# EAGLE design sensor_v8 (EAGLE 7.1.0)
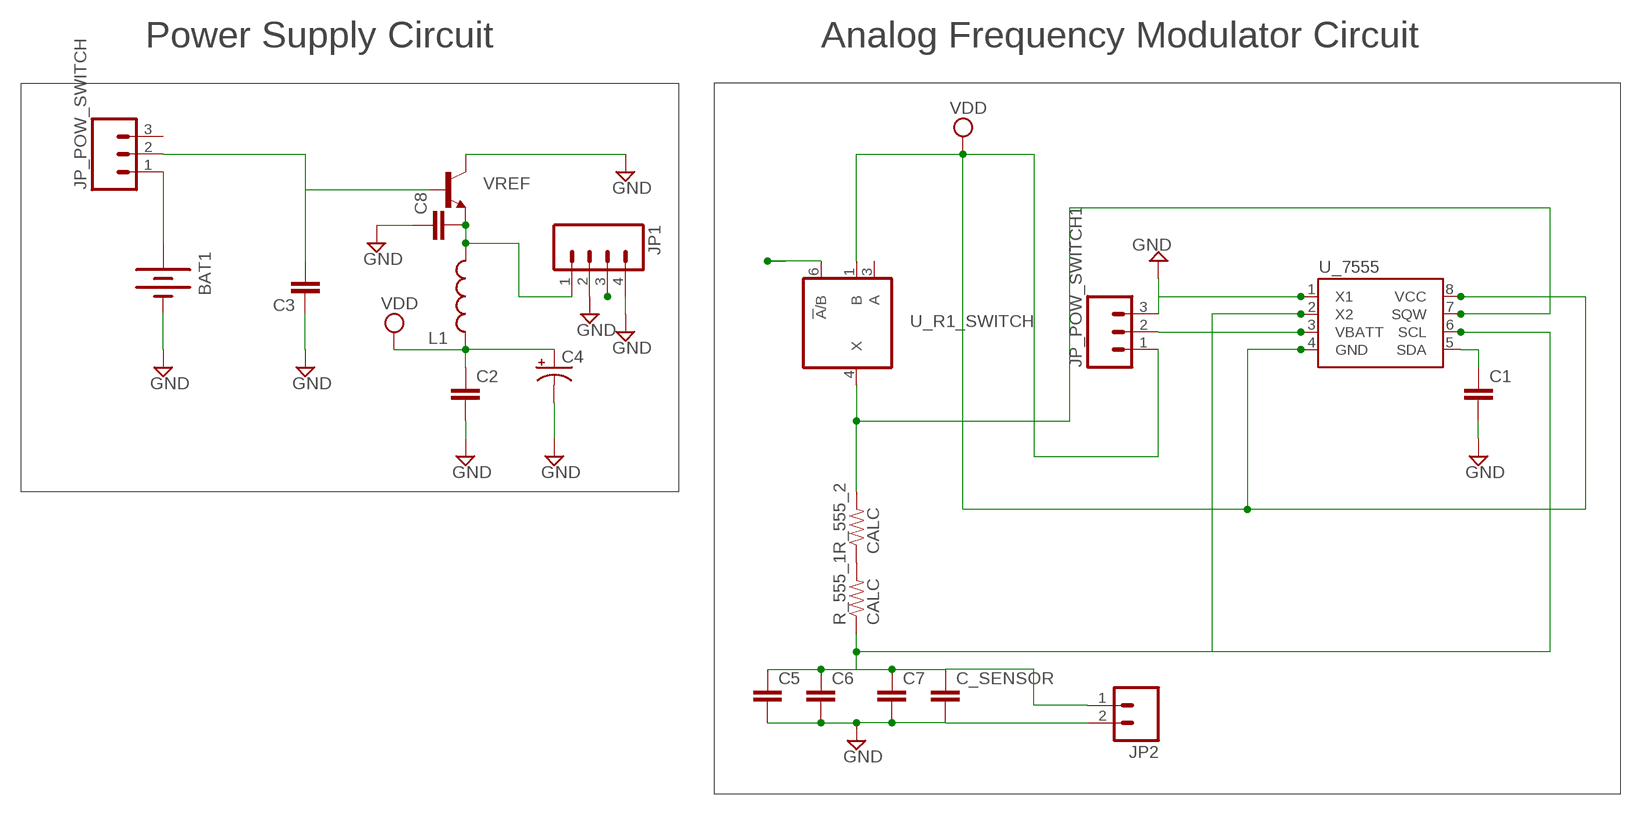
[diagram p0: schematic, sheet 1]

## Parts
BAT1  BATTERY20PTH_LAB  [BATTCOM_20MM_PTH]
C1  CAP0603-CAP  [0603-CAP]
C2  CAP0603-CAP  [0603-CAP]
C3  CAP0603-CAP  [0603-CAP]
C4  CAP_POL1206  [EIA3216]
C5  CAP0805  [0805]
C6  CAP0805  [0805]
C7  CAP0805  [0805]
C8  CAP0603-CAP  [0603-CAP]
C_SENSOR  CAP0805  [0805]
JP1  M04LOCK  [1X04_LOCK]
JP2  M02PTH  [1X02]
JP_POW_SWITCH  M03LOCK  [1X03_LOCK]
JP_POW_SWITCH1  M03LOCK  [1X03_LOCK]
L1  INDUCTOR0603  [0603]
R_555_1  CALC  RESISTOR0805-RES  [0805]
R_555_2  CALC  RESISTOR0805-RES  [0805]
U_7555  DS1307SO8  [SO08]
U_R1_SWITCH  741G3157DCKR  [DCK_R-PDSO-G6]
U_VREF  TRANSISTOR_NPNSOT23-3  [SOT23-3]

## Nets
FOUT: JP_POW_SWITCH1.2 U_7555.3(VBATT) U_R1_SWITCH.6(!A!/B)
GND: BAT1.2(-) C1.2 C2.2 C3.1 C4.C(-) C5.2 C6.2 C7.2 C8.1 C_SENSOR.2 JP1.2 JP1.4 JP2.2 JP_POW_SWITCH1.3 U_7555.1(X1) U_VREF.3(C)
N$6: BAT1.1(+) JP1.3 JP_POW_SWITCH.1
N$9: R_555_1.2 R_555_2.1
P2: C5.1 C6.1 C7.1 C_SENSOR.1 JP2.1 R_555_1.1 U_7555.2(X2) U_7555.6(SCL)
P5: C1.1 U_7555.5(SDA)
P7: R_555_2.2 U_7555.7(SQW) U_R1_SWITCH.4(X)
VDD: C2.1 C4.A(+) JP_POW_SWITCH1.1 L1.1 U_7555.4(GND) U_7555.8(VCC) U_R1_SWITCH.1(B)
VREFIN: C3.2 JP_POW_SWITCH.2 U_VREF.1(B)
VREFOUT: C8.2 JP1.1 L1.2 U_VREF.2(E)
Unconnected: JP_POW_SWITCH.3 U_R1_SWITCH.3(A)

## Notes on the sheet
- Power Supply Circuit | Analog Frequency Modulator Circuit
- VREF

## Power pins joined to a net without a drawn wire
GND: U_R1_SWITCH.2(GND)
VCC: U_R1_SWITCH.5(VCC)

## Library data of the parts
BAT1 = semipassiveTag_library:BATTERY: Battery Holders Various common sizes : AA, AAA, 20mm coin cell and 12mm coin cell.
C1-C3 C8 = SparkFun-Capacitors:CAP: Capacitor Standard 0603 ceramic capacitor, and 0.1" leaded capacitor.
C4 = SparkFun-Capacitors:CAP_POL: Capacitor Polarized These are standard SMD and PTH capacitors. Normally 10uF, 47uF, and 100uF in electrolytic and tantalum varieties. Always verify the external diameter of the through hole cap, it varies with capacity, voltage, and manufacturer. The EIA devices should be standard.
C5-C7 C_SENSOR = SparkFun:CAP: Capacitor Standard 0603 ceramic capacitor, and 0.1" leaded capacitor.
JP1 = SparkFun-Connectors:M04: Header 4 Standard 4-pin 0.1" header. Use with straight break away headers (SKU : PRT-00116), right angle break away headers (PRT-00553), swiss pins (PRT-00743), machine pins (PRT-00117), and female headers (PRT-00115). Molex polarized connector foot print use with SKU : PRT-08231 with associated crimp pins and housings. 1MM SMD Version SKU: PRT-10208
JP2 = SparkFun:M02: Header 2 Standard 2-pin 0.1" header. Use with straight break away headers (SKU : PRT-00116), right angle break away headers (PRT-00553), swiss pins (PRT-00743), machine pins (PRT-00117), and female headers (PRT-00115). Molex polarized connector foot print use with SKU : PRT-08233 with associated crimp pins and housings.
JP_POW_SWITCH JP_POW_SWITCH1 = SparkFun-Connectors:M03: Header 3 Standard 3-pin 0.1" header. Use with straight break away headers (SKU : PRT-00116), right angle break away headers (PRT-00553), swiss pins (PRT-00743), machine pins (PRT-00117), and female headers (PRT-00115). Molex polarized connector foot print use with SKU : PRT-08232 with associated crimp pins and housings.
L1 = SparkFun-Passives:INDUCTOR: Inductors Basic Inductor/Choke - 0603 and 1206. Footprints are not proven and vary greatly between part numbers.
R_555_1 R_555_2 = SparkFun-Resistors:RESISTOR: Resistor Basic schematic elements and footprints for 0603, 1206, and PTH resistors.
U_7555 = SparkFun-FreqCtrl:DS1307: I2C real-time clock with battery backup.
U_R1_SWITCH = 74xx-little-de:74*1G3157: Single-Pole, Double-Throw Analog Switch Source: http://focus.ti.com/lit/ds/symlink/sn74lvc1g3157.pdf
U_VREF = SparkFun:TRANSISTOR_NPN: Transistor NPN BJT configuration in SOT23 package. MMBT2222 is the common NPN we use. Double check BCE configuration again layout.

## Board
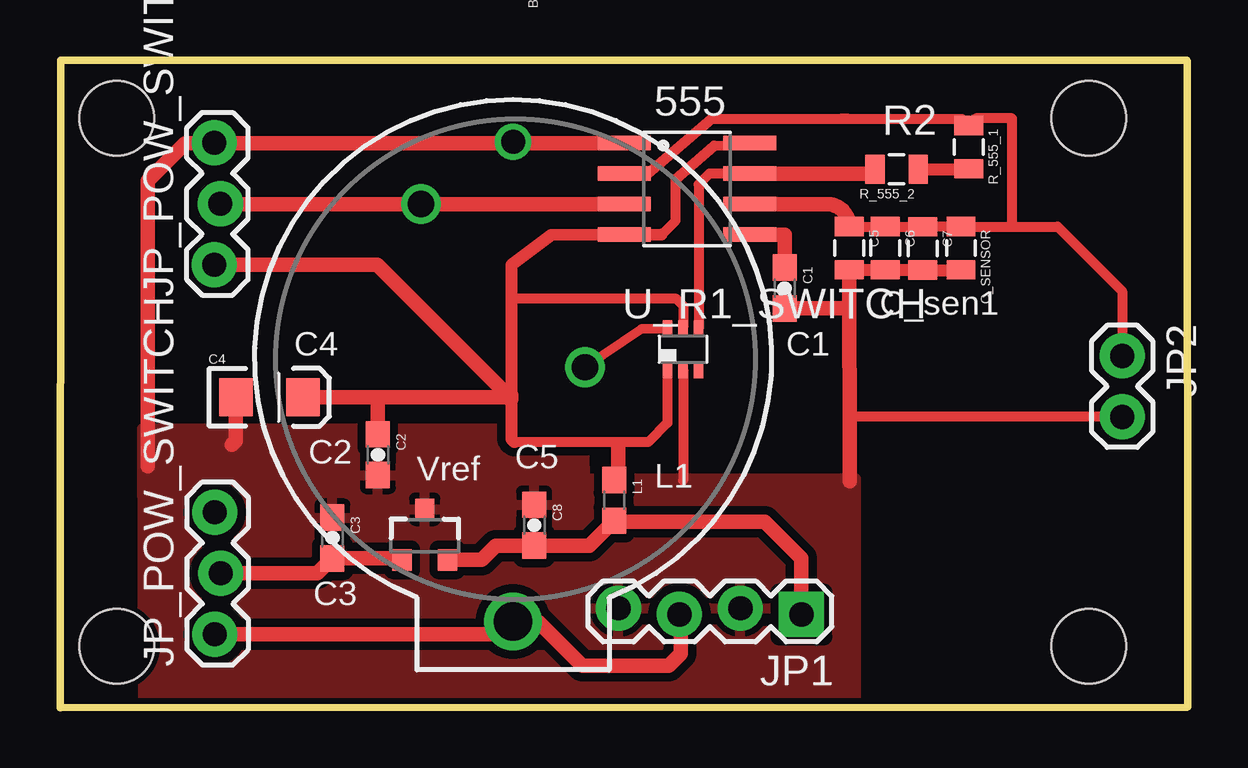
[diagram p1: board, top side]
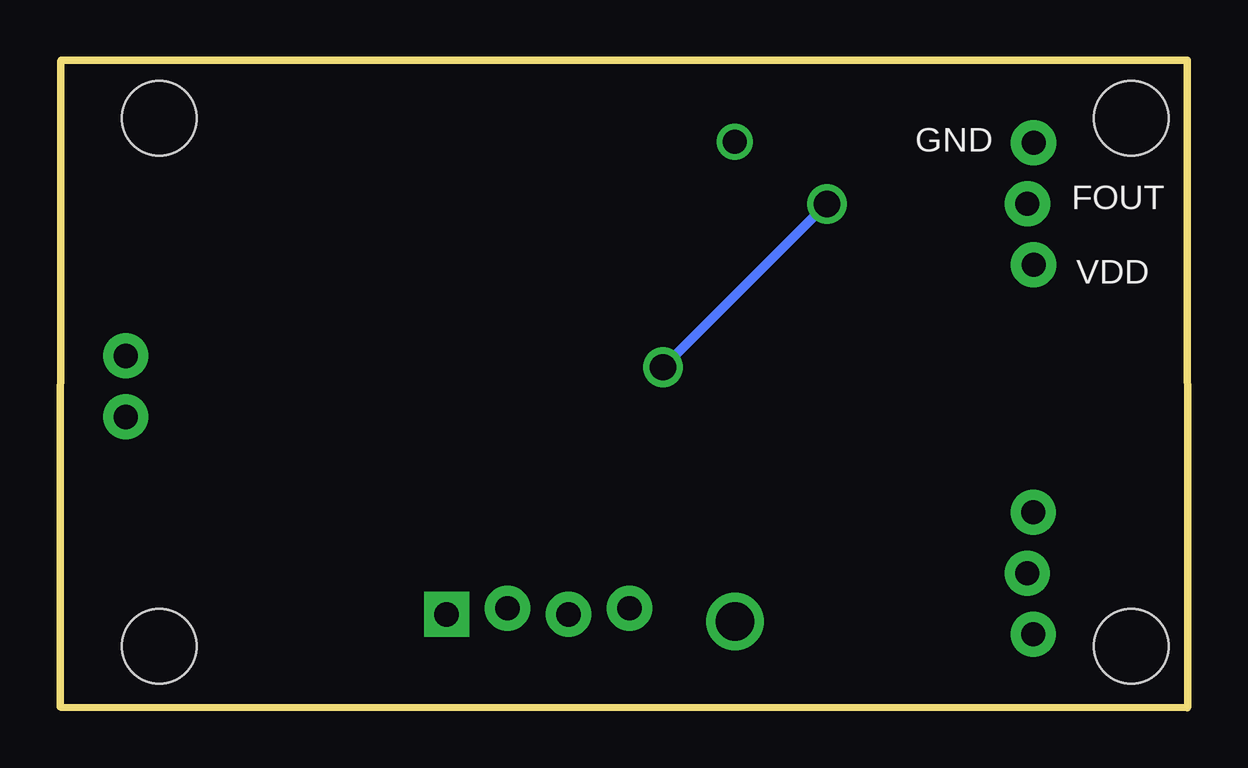
[diagram p2: board, bottom side, seen from below]

Size 47 x 26.98 mm. Coordinates in mm from the lower left corner, seen from the top.
Outline: 46.96,26.93 47,0.02
Outline: 0.03,26.97 0,0.03
Outline: 46.95,26.97 0.08,26.98
Outline: 0.02,0 46.95,0.01
Copper layers (1*16): Top 0.035mm / dielectric 1.5mm / Bottom 0.035mm
Design rules "Fusion_eagle_rule_v1.1 *": minimum track width 12mil, minimum drill 12mil, track to track 14mil, track to pad 14mil, pad to pad 14mil, via to via 14mil, smd to smd 0mil, copper to edge 10mil, drill to drill 10mil, minimum pad ring 10mil, minimum via ring 6mil, stop-mask expansion 2mil, vias tented up to drill 100mil, thermal gap 10mil
Holes 3.1 mm at 42.86,2.55 42.86,24.55 2.36,2.55 2.36,24.55

### Footprints (pad centres in the part's own frame; a part is rotated, then mirrored left to right if it is on the bottom)
BATTCOM_20MM_PTH = drill 1.6: 1 19.99,0 | drill 1: 2 0,0
0603-CAP = smd 1.1 x 1: 1 -0.85,0; 2 0.85,0
EIA3216 = smd 1.4 x 1.6: A 1.4,0; C -1.4,0
0805 = smd 0.8 x 1.2: 1 -0.9,0; 2 0.9,0
1X04_LOCK = drill 1.016 pad 1.88 square: 1 0,0.127 | drill 1.016 pad 1.88: 2 2.54,-0.127; 3 5.08,0.127; 4 7.62,-0.127
1X02 = drill 1.016 pad 1.88: 1 0,0; 2 2.54,0
1X03_LOCK = drill 1 pad 1.88: 1 0,0.127; 2 2.54,-0.127; 3 5.08,0.127
0603 = smd 1.1 x 1: 1 -0.85,0; 2 0.85,0
SO08 = smd 0.61 x 2.21: 1 -1.905,-2.616; 2 -0.635,-2.616; 3 0.635,-2.616; 4 1.905,-2.616; 5 1.905,2.616; 6 0.635,2.616; 7 -0.635,2.616; 8 -1.905,2.616
DCK_R-PDSO-G6 = smd 0.4 x 0.7: 1 -0.65,-0.85; 2 0,-0.85; 3 0.65,-0.85; 4 0.65,0.85; 5 0,0.85; 6 -0.65,0.85
SOT23-3 = smd 0.8 x 0.9: 1 -0.95,-1; 2 0.95,-1; 3 0,1.1

### Placement (x,y rotation side)
BAT1  18.88,23.57 270 top
C1  30.19,17.48 270 top
C2  13.24,10.54 270 top
C3  11.34,7.07 270 top
C4  8.73,12.93 0 top
C5  32.89,19.14 270 top
C6  34.39,19.14 270 top
C7  35.95,19.13 270 top
C8  19.76,7.6 270 top
C_SENSOR  37.54,19.14 270 top
JP1  30.89,4.01 180 top
JP2  44.26,14.65 270 top
JP_POW_SWITCH  6.57,3.05 90 top
JP_POW_SWITCH1  6.56,18.45 90 top
L1  23.09,8.63 270 top
R_555_1  37.86,23.35 270 top
R_555_2  34.86,22.43 180 top
U_7555  26.13,21.61 270 top
U_R1_SWITCH  25.96,14.93 0 top
U_VREF  15.2,7.15 0 top

### Tracks (layer width: path | path; a pad name or v marks a point on that pad's centre or on a via)
FOUT  (via drill 1.1)
  Top 0.4: U_R1_SWITCH.6 24.24,15.78 v21.87,14.18
  Top 0.406: JP_POW_SWITCH1.2 6.56,20.99
  Top 0.61: 23.5,20.97 arc45 U_7555.3 v15.05,20.98 6.69,20.98 JP_POW_SWITCH1.2
  Bottom 0.406: v21.87,14.18 v15.06,20.99 v15.06,20.98 v15.05,20.98
GND
  Top 0.406: C5.2 35.36,18.24 | U_R1_SWITCH.2 25.96,9.45 | 18.93,23.52 BAT1.2 | 6.45,23.52 6.43,23.52 JP_POW_SWITCH1.3 | JP2.2 32.96,12.11 32.9,12.05
  Top 0.5: C5.2 C6.2 35.36,18.24 C7.2 C_SENSOR.2
  Top 0.61: C5.2 32.89,16.25 | 32.89,16.25 32.9,12.05 32.9,9.42 | U_7555.1 18.93,23.52 6.45,23.52 5.23,23.52 3.66,21.95 3.66,10.05 | C1.2 32.89,16.63 32.89,16.25 | C4.C 7.33,11.12 7.16,10.95
  pour Top: 3.42,11.63 21.82,11.63 21.86,9.55 33.16,9.55 33.16,-0.05 3.46,0.05
N$4
  Top 0.406: 18.79,17.04 18.79,17.03 25.68,17.03 25.96,16.75 25.96,15.85
N$6
  Top 0.61: 18.88,3.55 BAT1.1 | BAT1.1 19.93,3.58 21.76,1.75 25.36,1.75 25.86,2.25 25.86,3.83 JP1.3 | JP_POW_SWITCH.1 18.34,3.05 BAT1.1
N$9
  Top 0.5: R_555_2.1 37.86,22.43 R_555_1.2
P2
  Top 0.406: 23.59,22.22 23.46,22.22 U_7555.2 24.48,22.22 27.16,24.53 32.86,24.53 | 32.86,24.53 32.56,24.54 | C5.1 C6.1 C7.1 35.95,20.05 | 39.66,20.04 39.66,24.55 38.16,24.55 R_555_1.1 37.58,24.53 32.86,24.53 | 39.66,20.04 C_SENSOR.1 35.95,20.05 | 35.41,20.05 35.95,20.05 | 39.66,20.04 41.57,20.04 44.26,17.35 JP2.1
  Top 0.6: 31.95,20.98 arc-90 C5.1
  Top 0.61: U_7555.6 31.95,20.98
P5
  Top 0.406: U_7555.5 29.49,19.71
  Top 0.61: 29.49,19.71 30.19,19.71 C1.1
P7
  Top 0.406: U_7555.7 27.06,22.25 26.61,21.8 U_R1_SWITCH.4
  Top 0.61: U_7555.7 33.96,22.25 R_555_2.2
VDD
  Top 0.4: 27.26,23.41 28.05,23.41 28.05,23.49
  Top 0.406: U_7555.4 25.07,19.71 25.65,20.29 25.65,22.01 27.26,23.41 | 28.05,23.49 U_7555.8 | 18.64,12.93 18.68,12.88 | U_R1_SWITCH.1 25.31,11.86 24.51,11.06 23.16,11.06 | 23.16,11.06 18.93,11.06 | 23.26,10.96 23.16,11.06
  Top 0.5: 18.81,13.01 18.81,18.43 20.47,19.69 25.07,19.71 | 18.81,12.85 18.81,11.18 18.93,11.06
  Top 0.61: 18.68,12.88 18.81,13.01 18.81,12.9 | 23.26,9.48 L1.1 23.26,9.65 23.26,10.96 | C4.A 13.36,12.93 | 13.36,12.93 18.64,12.93 | C2.1 13.24,12.81 13.36,12.93 | JP_POW_SWITCH1.1 13.21,18.45 18.76,12.9 | 18.76,12.9 18.81,12.85 | 18.81,12.9 18.76,12.85 | 18.81,12.9 18.76,12.9
VREFIN
  Top 0.61: U_VREF.1 14.25,6.21 C3.2 10.72,5.59 JP_POW_SWITCH.2
VREFOUT
  Top 0.61: U_VREF.2 17.56,6.15 18.16,6.75 C8.2 22.06,6.75 L1.2 23.12,7.75 29.36,7.75 30.89,6.22 JP1.1

### Text on the board
tPlace: 555 | R2 | C_sen1 | C4 | C1 | C2 | Vref | C5 | L1 | C3
bPlace: GND | FOUT | VDD